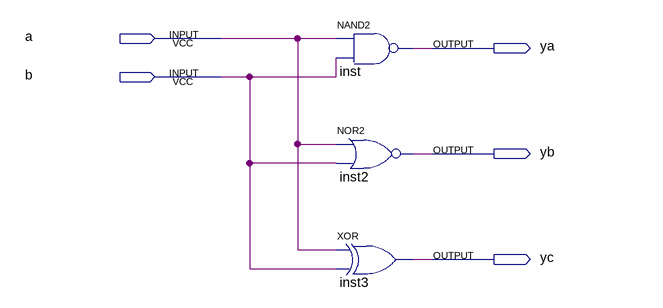
[diagram p0: schematic sheet]
// Quartus schematic logic_sche.bdf as structural Verilog: 3 symbols, 5 pins
module logic_sche (
  input  a,
  input  b,
  output ya,
  output yb,
  output yc
);

  nand inst (ya, a, b);
  nor inst2 (yb, a, b);
  xor inst3 (yc, a, b);
endmodule
